# EAGLE schematic fpga (EAGLE 4.16)
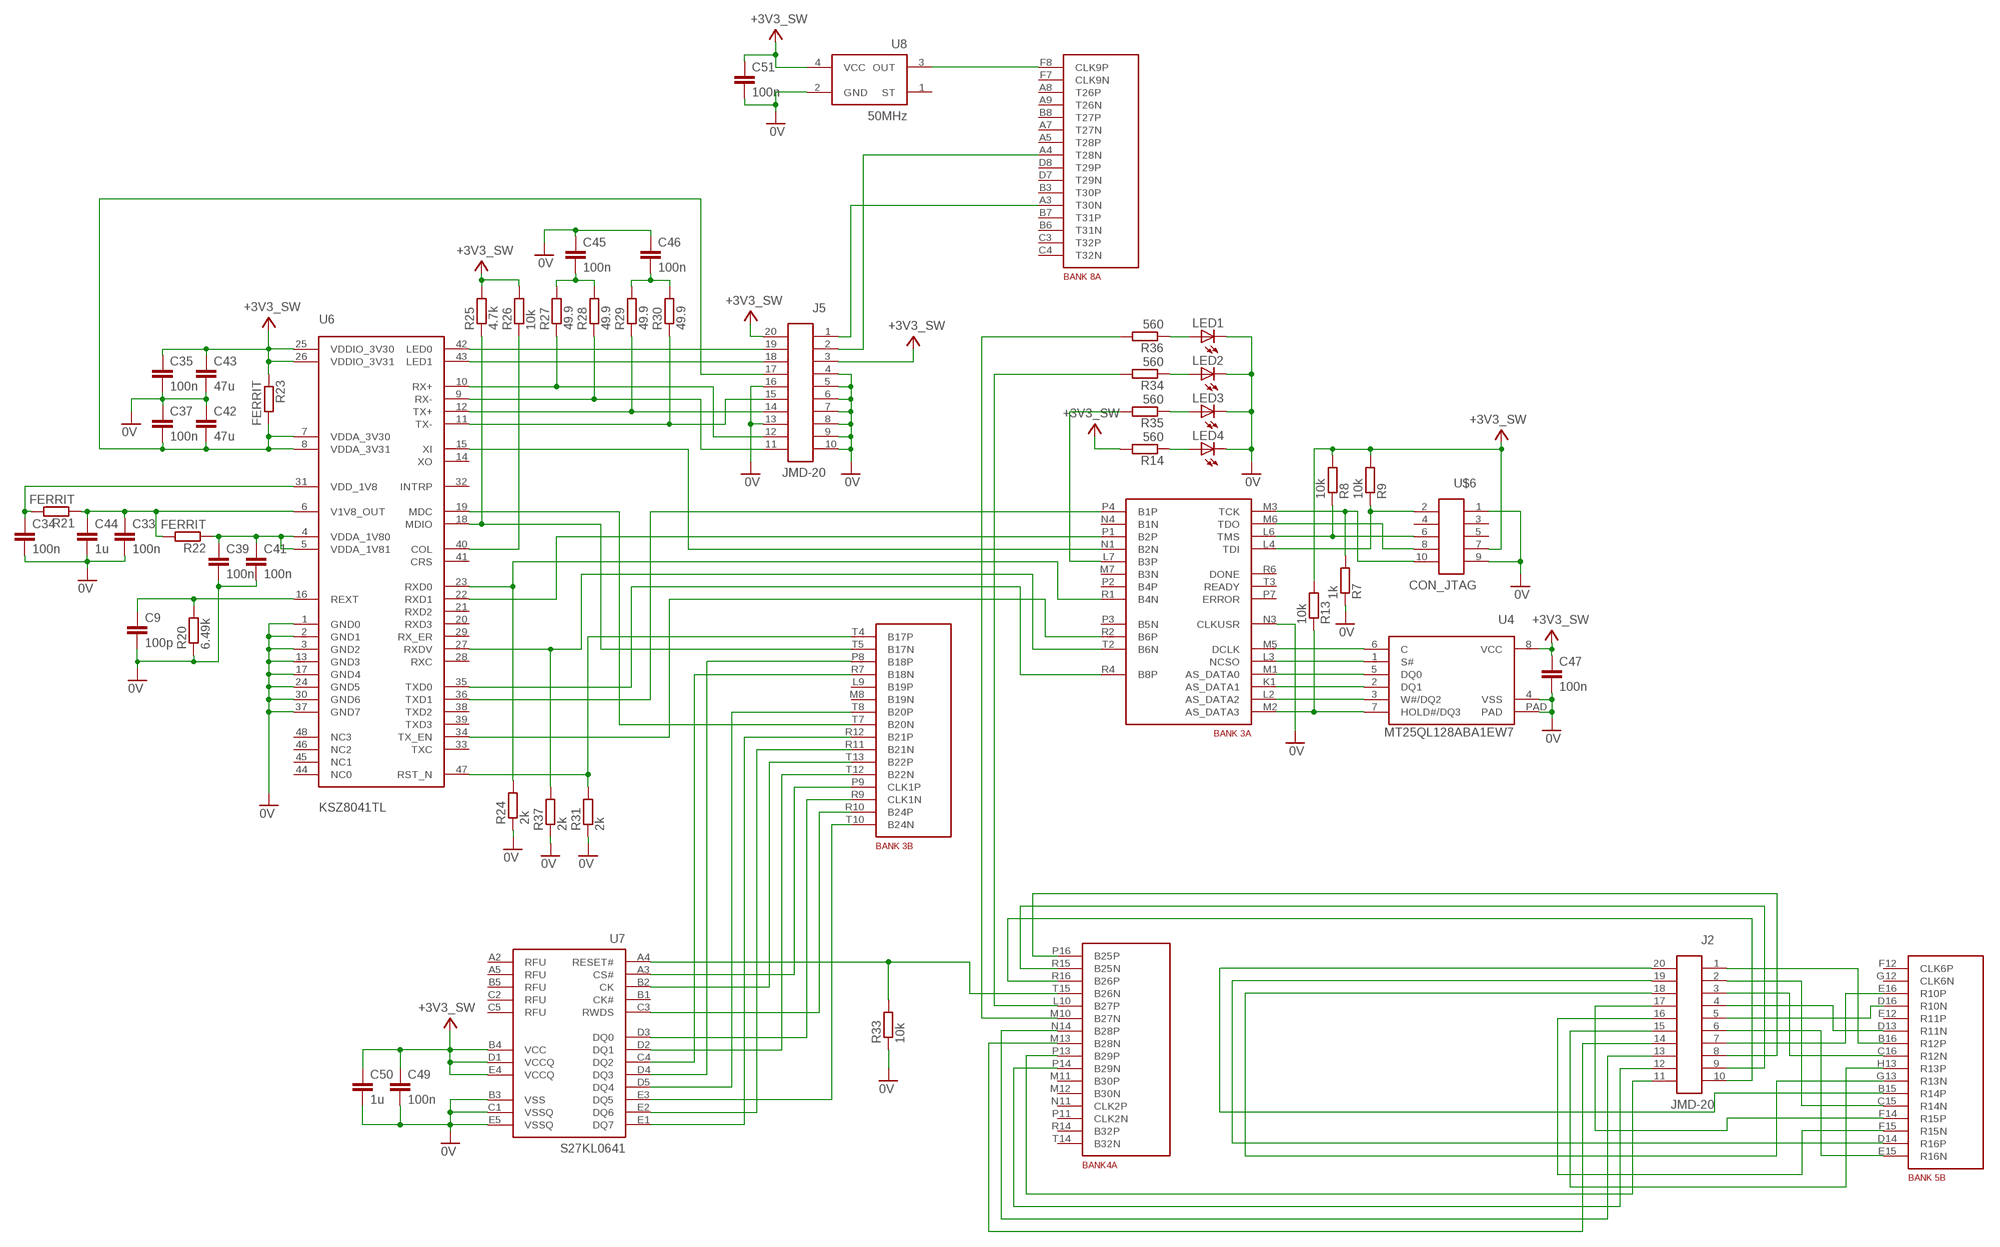
[diagram p0: schematic, sheet 1, part 1 of 2]
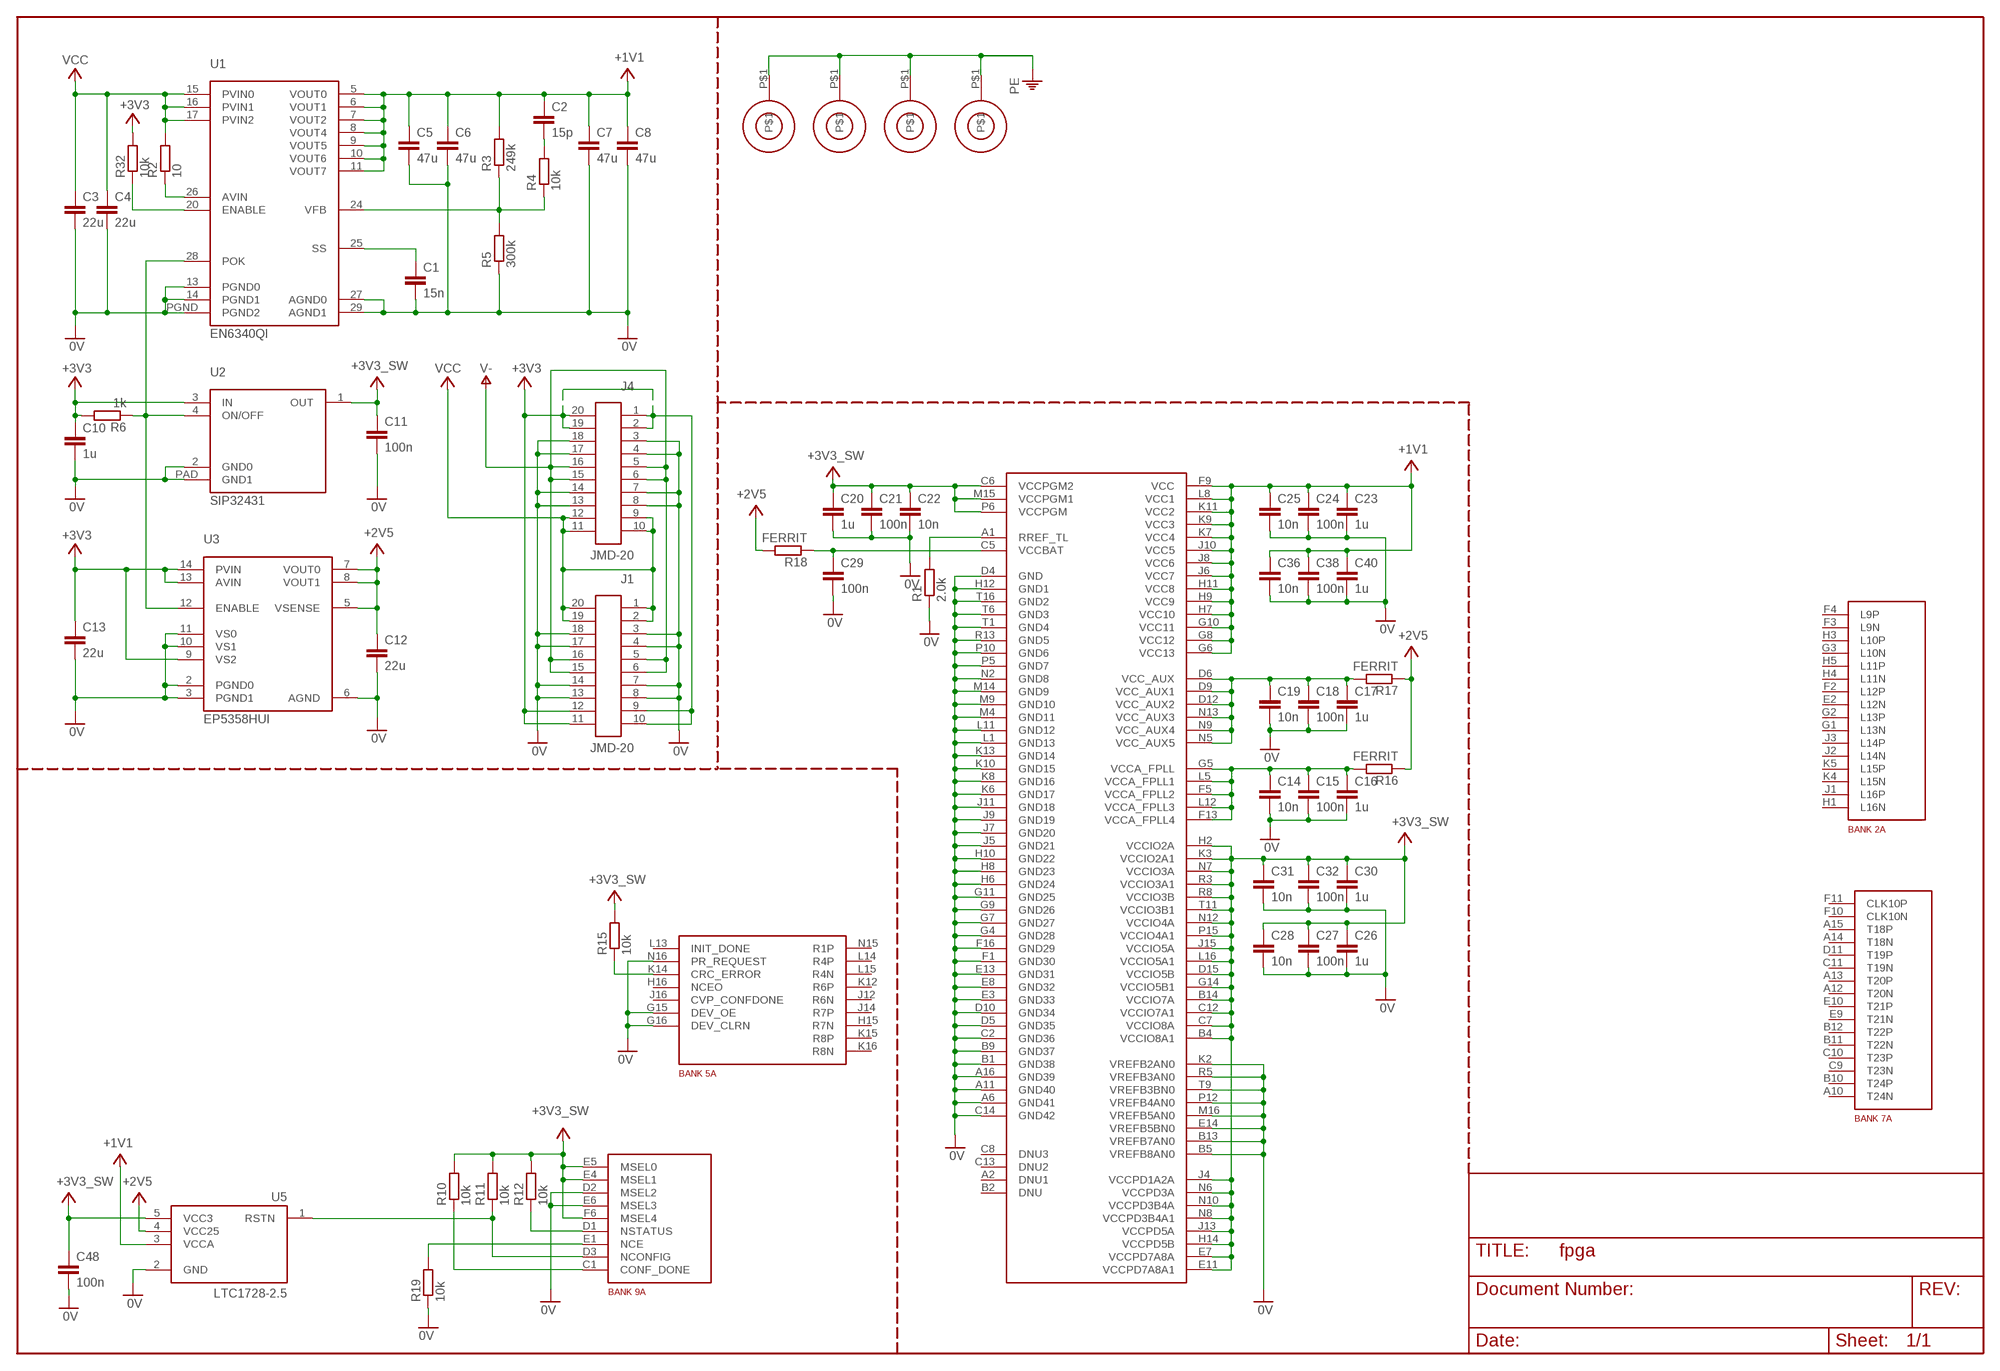
[diagram p1: schematic, sheet 1, part 2 of 2]

## Parts
C1  15n  C-EUC0603  [C0603]
C2  15p  C-EUC0603  [C0603]
C3  22u  C-EUC0805  [C0805]
C4  22u  C-EUC0805  [C0805]
C5  47u  C-EUC0805  [C0805]
C6  47u  C-EUC0805  [C0805]
C7  47u  C-EUC0805  [C0805]
C8  47u  C-EUC0805  [C0805]
C9  100p  C-EUC0603  [C0603]
C10  1u  C-EUC0603  [C0603]
C11  100n  C-EUC0603  [C0603]
C12  22u  C-EUC0805  [C0805]
C13  22u  C-EUC0805  [C0805]
C14  10n  C-EUC0603  [C0603]
C15  100n  C-EUC0603  [C0603]
C16  1u  C-EUC0603  [C0603]
C17  1u  C-EUC0603  [C0603]
C18  100n  C-EUC0603  [C0603]
C19  10n  C-EUC0603  [C0603]
C20  1u  C-EUC0603  [C0603]
C21  100n  C-EUC0603  [C0603]
C22  10n  C-EUC0603  [C0603]
C23  1u  C-EUC0603  [C0603]
C24  100n  C-EUC0603  [C0603]
C25  10n  C-EUC0603  [C0603]
C26  1u  C-EUC0603  [C0603]
C27  100n  C-EUC0603  [C0603]
C28  10n  C-EUC0603  [C0603]
C29  100n  C-EUC0603  [C0603]
C30  1u  C-EUC0603  [C0603]
C31  10n  C-EUC0603  [C0603]
C32  100n  C-EUC0603  [C0603]
C33  100n  C-EUC0603  [C0603]
C34  100n  C-EUC0603  [C0603]
C35  100n  C-EUC0603  [C0603]
C36  10n  C-EUC0603  [C0603]
C37  100n  C-EUC0603  [C0603]
C38  100n  C-EUC0603  [C0603]
C39  100n  C-EUC0603  [C0603]
C40  1u  C-EUC0603  [C0603]
C41  100n  C-EUC0603  [C0603]
C42  47u  C-EUC0805  [C0805]
C43  47u  C-EUC0805  [C0805]
C44  1u  C-EUC0603  [C0603]
C45  100n  C-EUC0603  [C0603]
C46  100n  C-EUC0603  [C0603]
C47  100n  C-EUC0603  [C0603]
C48  100n  C-EUC0603  [C0603]
C49  100n  C-EUC0603  [C0603]
C50  1u  C-EUC0603  [C0603]
C51  100n  C-EUC0603  [C0603]
J1  JMD-20  [CON]
J2  JMD-20  [CON]
J4  JMD-20  [CON]
J5  JMD-20  [CON]
LED1  LEDCHIP-LED0603  [CHIP-LED0603]
LED2  LEDCHIP-LED0603  [CHIP-LED0603]
LED3  LEDCHIP-LED0603  [CHIP-LED0603]
LED4  LEDCHIP-LED0603  [CHIP-LED0603]
R1  2.0k  R-EU_R0603  [R0603]
R2  10  R-EU_R0603  [R0603]
R3  249k  R-EU_R0603  [R0603]
R4  10k  R-EU_R0603  [R0603]
R5  300k  R-EU_R0603  [R0603]
R6  1k  R-EU_R0603  [R0603]
R7  1k  R-EU_R0603  [R0603]
R8  10k  R-EU_R0603  [R0603]
R9  10k  R-EU_R0603  [R0603]
R10  10k  R-EU_R0603  [R0603]
R11  10k  R-EU_R0603  [R0603]
R12  10k  R-EU_R0603  [R0603]
R13  10k  R-EU_R0603  [R0603]
R14  560  R-EU_R0603  [R0603]
R15  10k  R-EU_R0603  [R0603]
R16  FERRIT  R-EU_R0603  [R0603]
R17  FERRIT  R-EU_R0603  [R0603]
R18  FERRIT  R-EU_R0603  [R0603]
R19  10k  R-EU_R0603  [R0603]
R20  6.49k  R-EU_R0603  [R0603]
R21  FERRIT  R-EU_R0603  [R0603]
R22  FERRIT  R-EU_R0603  [R0603]
R23  FERRIT  R-EU_R0603  [R0603]
R24  2k  R-EU_R0603  [R0603]
R25  4.7k  R-EU_R0603  [R0603]
R26  10k  R-EU_R0603  [R0603]
R27  49.9  R-EU_R0603  [R0603]
R28  49.9  R-EU_R0603  [R0603]
R29  49.9  R-EU_R0603  [R0603]
R30  49.9  R-EU_R0603  [R0603]
R31  2k  R-EU_R0603  [R0603]
R32  10k  R-EU_R0603  [R0603]
R33  10k  R-EU_R0603  [R0603]
R34  560  R-EU_R0603  [R0603]
R35  560  R-EU_R0603  [R0603]
R36  560  R-EU_R0603  [R0603]
R37  2k  R-EU_R0603  [R0603]
U1  EN6340QI  [EN6340QI]
U2  SIP32431  [SIP32431]
U3  EP5358HUI  [EP5358HUI]
U4  MT25QL128ABA1EW7  [MT25Q128AB]
U5  LTC1728-2.5  [SOT-23-5]
U6  KSZ8041TL  [48TQFP]
U7  S27KL0641  [24FBGA]
U8  50MHz  OSC  [OSC]
U$1  5CEBA2F17C8N  [256FBGA]
U$3  MOUNT  [MOUNT]
U$4  MOUNT  [MOUNT]
U$6  CON_JTAG  [HEADER_10_H]
U$7  MOUNT  [MOUNT]
U$11  MOUNT  [MOUNT]

## Nets
0V: C1.2 C3.2 C4.2 C5.2 C6.2 C7.2 C8.2 C9.2 C10.2 C11.2 C12.2 C13.2 C14.2 C15.2 C16.2 C17.2 C18.2 C19.2 C20.2 C21.2 C22.2 C23.2 C24.2 C25.2 C26.2 C27.2 C28.2 C29.2 C30.2 C31.2 C32.2 C33.2 C34.2 C35.2 C36.2 C37.1 C38.2 C39.2 C40.2 C41.2 C42.1 C43.2 C44.2 C45.1 C46.1 C47.2 C48.2 C49.2 C50.2 C51.2 J1.3 J1.4 J1.7 J1.8 J1.13 J1.14 J1.17 J1.18 J4.3 J4.4 J4.7 J4.8 J4.13 J4.14 J4.17 J4.18 J5.4 J5.5 J5.6 J5.7 J5.8 J5.9 J5.10 J5.13 J5.16 LED1.C LED2.C LED3.C LED4.C R1.1 R5.1 R7.1 R19.1 R20.1 R24.1 R31.1 R33.1 R37.1 U1.13(PGND0) U1.14(PGND1) U1.27(AGND0) U1.29(AGND1) U1.PGND(PGND2) U2.2(GND0) U2.PAD(GND1) U3.2(PGND0) U3.3(PGND1) U3.6(AGND) U3.10(VS1) U3.11(VS0) U4.4(VSS) U4.PAD U5.2(GND) U6.1(GND0) U6.2(GND1) U6.3(GND2) U6.13(GND3) U6.17(GND4) U6.24(GND5) U6.30(GND6) U6.37(GND7) U7.B3(VSS) U7.C1(VSSQ) U7.E5(VSSQ) U8.2(GND) U$1.A6(GND41) U$1.A11(GND40) U$1.A16(GND39) U$1.B1(GND38) U$1.B5(VREFB8AN0) U$1.B9(GND37) U$1.B13(VREFB7AN0) U$1.C2(GND36) U$1.C14(GND42) U$1.D2(MSEL2) U$1.D4(GND) U$1.D5(GND35) U$1.D10(GND34) U$1.E3(GND33) U$1.E6(MSEL3) U$1.E8(GND32) U$1.E13(GND31) U$1.E14(VREFB5BN0) U$1.F1(GND30) U$1.F16(GND29) U$1.G4(GND28) U$1.G7(GND27) U$1.G9(GND26) U$1.G11(GND25) U$1.G15(DEV_OE) U$1.G16(DEV_CLRN) U$1.H6(GND24) U$1.H8(GND23) U$1.H10(GND22) U$1.H12(GND1) U$1.J5(GND21) U$1.J7(GND20) U$1.J9(GND19) U$1.J11(GND18) U$1.K2(VREFB2AN0) U$1.K6(GND17) U$1.K8(GND16) U$1.K10(GND15) U$1.K13(GND14) U$1.L1(GND13) U$1.L11(GND12) U$1.M4(GND11) U$1.M9(GND10) U$1.M14(GND9) U$1.M16(VREFB5AN0) U$1.N2(GND8) U$1.N3(CLKUSR) U$1.N16(PR_REQUEST) U$1.P5(GND7) U$1.P10(GND6) U$1.P12(VREFB4AN0) U$1.R5(VREFB3AN0) U$1.R13(GND5) U$1.T1(GND4) U$1.T6(GND3) U$1.T9(VREFB3BN0) U$1.T16(GND2) U$6.1 U$6.9
+1V1: C2.1 C5.1 C6.1 C7.1 C8.1 C23.1 C24.1 C25.1 C36.1 C38.1 C40.1 R3.2 U1.5(VOUT0) U1.6(VOUT1) U1.7(VOUT2) U1.8(VOUT4) U1.9(VOUT5) U1.10(VOUT6) U1.11(VOUT7) U5.3(VCCA) U$1.F9(VCC) U$1.G6(VCC13) U$1.G8(VCC12) U$1.G10(VCC11) U$1.H7(VCC10) U$1.H9(VCC9) U$1.H11(VCC8) U$1.J6(VCC7) U$1.J8(VCC6) U$1.J10(VCC5) U$1.K7(VCC4) U$1.K9(VCC3) U$1.K11(VCC2) U$1.L8(VCC1)
+2V5: C12.1 R16.1 R17.1 R18.2 U3.5(VSENSE) U3.7(VOUT0) U3.8(VOUT1) U5.4(VCC25)
+3V3: C10.1 C13.1 J1.9 J1.10 J1.11 J1.12 J4.1 J4.2 J4.19 J4.20 R6.2 R32.2 U2.3(IN) U3.9(VS2) U3.13(AVIN) U3.14(PVIN)
+3V3_SW: C11.1 C20.1 C21.1 C22.1 C26.1 C27.1 C28.1 C30.1 C31.1 C32.1 C35.1 C43.1 C47.1 C48.1 C49.1 C50.1 C51.1 J5.3 J5.20 R8.2 R9.2 R10.2 R11.2 R12.2 R13.2 R14.2 R15.2 R23.1 R25.2 R26.2 U2.1(OUT) U4.8(VCC) U5.5(VCC3) U6.25(VDDIO_3V30) U6.26(VDDIO_3V31) U7.B4(VCC) U7.D1(VCCQ) U7.E4(VCCQ) U8.4(VCC) U$1.B4(VCCIO8A1) U$1.B14(VCCIO7A) U$1.C6(VCCPGM2) U$1.C7(VCCIO8A) U$1.C12(VCCIO7A1) U$1.D15(VCCIO5B) U$1.E4(MSEL1) U$1.E5(MSEL0) U$1.E7(VCCPD7A8A) U$1.E11(VCCPD7A8A1) U$1.F6(MSEL4) U$1.G14(VCCIO5B1) U$1.H2(VCCIO2A) U$1.H14(VCCPD5B) U$1.J4(VCCPD1A2A) U$1.J13(VCCPD5A) U$1.J15(VCCIO5A) U$1.K3(VCCIO2A1) U$1.L16(VCCIO5A1) U$1.M15(VCCPGM1) U$1.N6(VCCPD3A) U$1.N7(VCCIO3A) U$1.N8(VCCPD3B4A1) U$1.N10(VCCPD3B4A) U$1.N12(VCCIO4A) U$1.P6(VCCPGM) U$1.P15(VCCIO4A1) U$1.R3(VCCIO3A1) U$1.R8(VCCIO3B) U$1.T11(VCCIO3B1) U$6.7
I2C_SCL: J5.1 U$1.A3(T30N)
I2C_SDA: J5.2 U$1.A4(T28N)
N$4: R1.2 U$1.A1(RREF_TL)
N$5: C1.1 U1.25(SS)
N$6: R2.1 U1.26(AVIN)
N$7: C2.2 R4.2
N$8: R3.1 R4.1 R5.2 U1.24(VFB)
N$9: R6.1 U1.28(POK) U2.4(ON/OFF) U3.12(ENABLE)
N$10: U$1.M6(TDO) U$6.8
N$11: LED4.A R14.1
N$13: U4.6(C) U$1.M5(DCLK)
N$14: R12.1 U$1.D1(NSTATUS)
N$15: R11.1 U5.1(RSTN) U$1.D3(NCONFIG)
N$16: R10.1 U$1.C1(CONF_DONE)
N$17: U4.1(S#) U$1.L3(NCSO)
N$18: U4.5(DQ0) U$1.M1(AS_DATA0)
N$19: U4.2(DQ1) U$1.K1(AS_DATA1)
N$20: U4.3(W#/DQ2) U$1.L2(AS_DATA2)
N$21: R13.1 U4.7(HOLD#/DQ3) U$1.M2(AS_DATA3)
N$23: R15.1 U$1.K14(CRC_ERROR)
N$24: C14.1 C15.1 C16.1 R16.2 U$1.F5(VCCA_FPLL2) U$1.F13(VCCA_FPLL4) U$1.G5(VCCA_FPLL) U$1.L5(VCCA_FPLL1) U$1.L12(VCCA_FPLL3)
N$25: C17.1 C18.1 C19.1 R17.2 U$1.D6(VCC_AUX) U$1.D9(VCC_AUX1) U$1.D12(VCC_AUX2) U$1.N5(VCC_AUX5) U$1.N9(VCC_AUX4) U$1.N13(VCC_AUX3)
N$26: C29.1 R18.1 U$1.C5(VCCBAT)
N$27: R19.2 U$1.E1(NCE)
N$28: C9.1 R20.2 U6.16(REXT)
N$29: C33.1 C44.1 R21.1 R22.2 U6.6(V1V8_OUT)
N$30: U6.19(MDC) U$1.T7(B20N)
N$31: C37.2 C42.2 J5.17 R23.2 U6.7(VDDA_3V30) U6.8(VDDA_3V31)
N$32: C34.1 R21.2 U6.31(VDD_1V8)
N$33: R25.1 U6.18(MDIO) U$1.T5(B17N)
N$34: C39.1 C41.1 R22.1 U6.4(VDDA_1V80) U6.5(VDDA_1V81)
N$35: R31.2 U6.47(RST_N) U$1.T4(B17P)
N$36: U6.34(TX_EN) U$1.R2(B6P)
N$37: U6.35(TXD0) U$1.R4(B8P)
N$38: U6.36(TXD1) U$1.P4(B1P)
N$39: C45.2 R27.2 R28.2
N$40: R37.2 U6.27(RXDV) U$1.T2(B6N)
N$41: C46.2 R29.2 R30.2
N$42: R24.2 U6.23(RXD0) U$1.R1(B4N)
N$43: U6.22(RXD1) U$1.P1(B2P)
N$47: R26.1 U6.40(COL)
N$48: R32.1 U1.20(ENABLE)
N$49: U6.15(XI) U$1.N1(B2N)
N$50: J5.19 U6.42(LED0)
N$51: J5.18 U6.43(LED1)
N$53: J5.12 R27.1 U6.10(RX+)
N$54: J5.11 R28.1 U6.9(RX-)
N$55: J5.14 R29.1 U6.12(TX+)
N$56: J5.15 R30.1 U6.11(TX-)
N$57: U7.E3(DQ5) U$1.T10(B24N)
N$58: U7.A3(CS#) U$1.P9(CLK1P)
N$59: U7.D3(DQ0) U$1.R9(CLK1N)
N$60: U7.C3(RWDS) U$1.R10(B24P)
N$61: U7.D2(DQ1) U$1.T12(B22N)
N$62: U7.B2(CK) U$1.T13(B22P)
N$63: U7.E2(DQ6) U$1.R11(B21N)
N$64: U7.E1(DQ7) U$1.R12(B21P)
N$67: U7.D5(DQ4) U$1.T8(B20P)
N$68: R33.2 U7.A4(RESET#) U$1.T15(B26N)
N$69: U7.D4(DQ3) U$1.P8(B18P)
N$70: U7.C4(DQ2) U$1.R7(B18N)
N$71: J2.7 U$1.E16(R10P)
N$72: J2.5 U$1.D16(R10N)
N$73: J2.3 U$1.C16(R12N)
N$74: J2.4 U$1.D13(R11N)
N$75: J2.18 U$1.G13(R13N)
N$76: J2.2 U$1.C15(R14N)
N$77: J2.17 U$1.F14(R15P)
N$78: J2.6 U$1.E15(R16N)
N$79: J2.19 U$1.D14(R16P)
N$80: J2.16 U$1.F15(R15N)
N$82: J2.20 U$1.B15(R14P)
N$83: J2.8 U$1.P16(B25P)
N$84: J2.11 U$1.P13(B29P)
N$85: J2.14 U$1.M13(B28N)
N$86: J2.12 U$1.P14(B29N)
N$87: J2.13 U$1.N14(B28P)
N$89: J2.15 U$1.H13(R13P)
N$90: J2.1 U$1.B16(R12P)
N$91: J2.9 U$1.R15(B25N)
N$92: J2.10 U$1.R16(B26P)
N$97: R35.2 U$1.L7(B3P)
N$98: R34.2 U$1.L10(B27P)
N$99: LED1.A R36.1
N$100: R36.2 U$1.M10(B27N)
N$101: LED2.A R34.1
N$102: LED3.A R35.1
N$109: U8.3(OUT) U$1.F8(CLK9P)
PE: U$3.P$1 U$4.P$1 U$7.P$1 U$11.P$1
TCK: R7.2 U$1.M3(TCK) U$6.10
TDI: R9.1 U$1.L4(TDI) U$6.2
TMS: R8.1 U$1.L6(TMS) U$6.6
V-: J1.5 J1.6 J1.15 J1.16 J4.5 J4.6 J4.15 J4.16
VCC: C3.1 C4.1 J1.1 J1.2 J1.19 J1.20 J4.9 J4.10 J4.11 J4.12 R2.2 U1.15(PVIN0) U1.16(PVIN1) U1.17(PVIN2)
Unconnected: U6.14(XO) U6.20(RXD3) U6.21(RXD2) U6.28(RXC) U6.29(RX_ER) U6.32(INTRP) U6.33(TXC) U6.38(TXD2) U6.39(TXD3) U6.41(CRS) U6.44(NC0) U6.45(NC1) U6.46(NC2) U6.48(NC3) U7.A2(RFU) U7.A5(RFU) U7.B1(CK#) U7.B5(RFU) U7.C2(RFU) U7.C5(RFU) U8.1(ST) U$1.A2(DNU1) U$1.A5(T28P) U$1.A7(T27N) U$1.A8(T26P) U$1.A9(T26N) U$1.A10(T24N) U$1.A12(T20N) U$1.A13(T20P) U$1.A14(T18N) U$1.A15(T18P) U$1.B2(DNU) U$1.B3(T30P) U$1.B6(T31N) U$1.B7(T31P) U$1.B8(T27P) U$1.B10(T24P) U$1.B11(T22N) U$1.B12(T22P) U$1.C3(T32P) U$1.C4(T32N) U$1.C8(DNU3) U$1.C9(T23N) U$1.C10(T23P) U$1.C11(T19N) U$1.C13(DNU2) U$1.D7(T29N) U$1.D8(T29P) U$1.D11(T19P) U$1.E2(L12N) U$1.E9(T21N) U$1.E10(T21P) U$1.E12(R11P) U$1.F2(L12P) U$1.F3(L9N) U$1.F4(L9P) U$1.F7(CLK9N) U$1.F10(CLK10N) U$1.F11(CLK10P) U$1.F12(CLK6P) U$1.G1(L13N) U$1.G2(L13P) U$1.G3(L10N) U$1.G12(CLK6N) U$1.H1(L16N) U$1.H3(L10P) U$1.H4(L11N) U$1.H5(L11P) U$1.H15(R7N) U$1.H16(NCEO) U$1.J1(L16P) U$1.J2(L14N) U$1.J3(L14P) U$1.J12(R6N) U$1.J14(R7P) U$1.J16(CVP_CONFDONE) U$1.K4(L15N) U$1.K5(L15P) U$1.K12(R6P) U$1.K15(R8P) U$1.K16(R8N) U$1.L9(B19P) U$1.L13(INIT_DONE) U$1.L14(R4P) U$1.L15(R4N) U$1.M7(B3N) U$1.M8(B19N) U$1.M11(B30P) U$1.M12(B30N) U$1.N4(B1N) U$1.N11(CLK2P) U$1.N15(R1P) U$1.P2(B4P) U$1.P3(B5N) U$1.P7(ERROR) U$1.P11(CLK2N) U$1.R6(DONE) U$1.R14(B32P) U$1.T3(READY) U$1.T14(B32N) U$6.3 U$6.4 U$6.5

## Library data of the parts
C1-C51 = rcl:C-EU: CAPACITOR, European symbol
J1 J2 J4 J5 = trafo_mod:JMD-20
LED1-LED4 = led:LED: LED OSRAM: - CHIPLED LG R971, LG N971, LY N971, LG Q971, LY Q971, LO R971, LY R971 LH N974, LH R974 LS Q976, LO Q976, LY Q976 LO Q996 - Hyper CHIPLED LW Q18S LB Q993, LB Q99A, LB R99A - SideLED LS A670, LO A670, LY A670, LG A670, LP A670 LB A673, LV A673, LT A673, LW A673 LH A674 LY A675 LS A676, LA A676, LO A676, LY A676, LW A676 LS A679, LY A679, LG A679 - Hyper Micro SIDELED® LS Y876, LA Y876, LO Y876, LY Y876 LT Y87S - SmartLED LW L88C, LW L88S LB L89C, LB L89S, LG L890 LS L89K, LO L89K, LY L89K LS L896, LA L896, LO L896, LY L896 - TOPLED LS T670, LO T670, LY T670, LG T670, LP T670 LSG T670, LSP T670, LSY T670, LOP T670, LYG T670 LG T671, LOG T671, LSG T671 LB T673, LV T673, LT T673, LW T673 LH T674 LS T676, LA T676, LO T676, LY T676, LB T676, LH T676, LSB T676, LW T676 LB T67C, LV T67C, LT T67C, LS T67K, LO T67K, LY T67K, LW E67C LS E67B, LA E67B, LO E67B, LY E67B, LB E67C, LV E67C, LT E67C LW T67C LS T679, LY T679, LG T679 LS T770, LO T770, LY T770, LG T770, LP T770 LB T773, LV T773, LT T773, LW T773 LH T774 LS E675, LA E675, LY E675, LS T675 LS T776, LA T776, LO T776, LY T776, LB T776 LHGB T686 LT T68C, LB T68C - Hyper Mini TOPLED® LB M676 - Mini TOPLED Santana® LG M470 LS M47K, LO M47K, LY M47K Source: http://www.osram.convergy.de - LUMILED® LXK2-PW12-R00, LXK2-PW12-S00, LXK2-PW14-U00, LXK2-PW14-V00 LXK2-PM12-R00, LXK2-PM12-S00, LXK2-PM14-U00 LXK2-PE12-Q00, LXK2-PE12-R00, LXK2-PE12-S00, LXK2-PE14-T00, LXK2-PE14-U00 LXK2-PB12-K00, LXK2-PB12-L00, LXK2-PB12-M00, LXK2-PB14-N00, LXK2-PB14-P00, LXK2-PB14-Q00 LXK2-PR12-L00, LXK2-PR12-M00, LXK2-PR14-Q00, LXK2-PR14-R00 LXK2-PD12-Q00, LXK2-PD12-R00, LXK2-PD12-S00 LXK2-PH12-R00, LXK2-PH12-S00 LXK2-PL12-P00, LXK2-PL12-Q00, LXK2-PL12-R00 Source: www.luxeon.com
R1-R37 = rcl:R-EU_: RESISTOR, European symbol
U1 = trafo_mod:EN6340QI
U2 = trafo_mod:SIP32431
U3 = trafo_mod:EP5358HUI
U4 = trafo_mod:MT25QL128ABA1EW7
U5 = trafo_mod:LTC1728-2.5
U6 = trafo_mod:KSZ8041TL
U7 = trafo_mod:S27KL0641
U8 = trafo_mod:OSC
U$1 = trafo_mod:5CEBA2F17C8N
U$3 U$4 U$7 U$11 = trafo_mod:MOUNT
U$6 = trafo_mod:CON_JTAG